# Altium schematic sheet Sheet1.SchDoc
size A
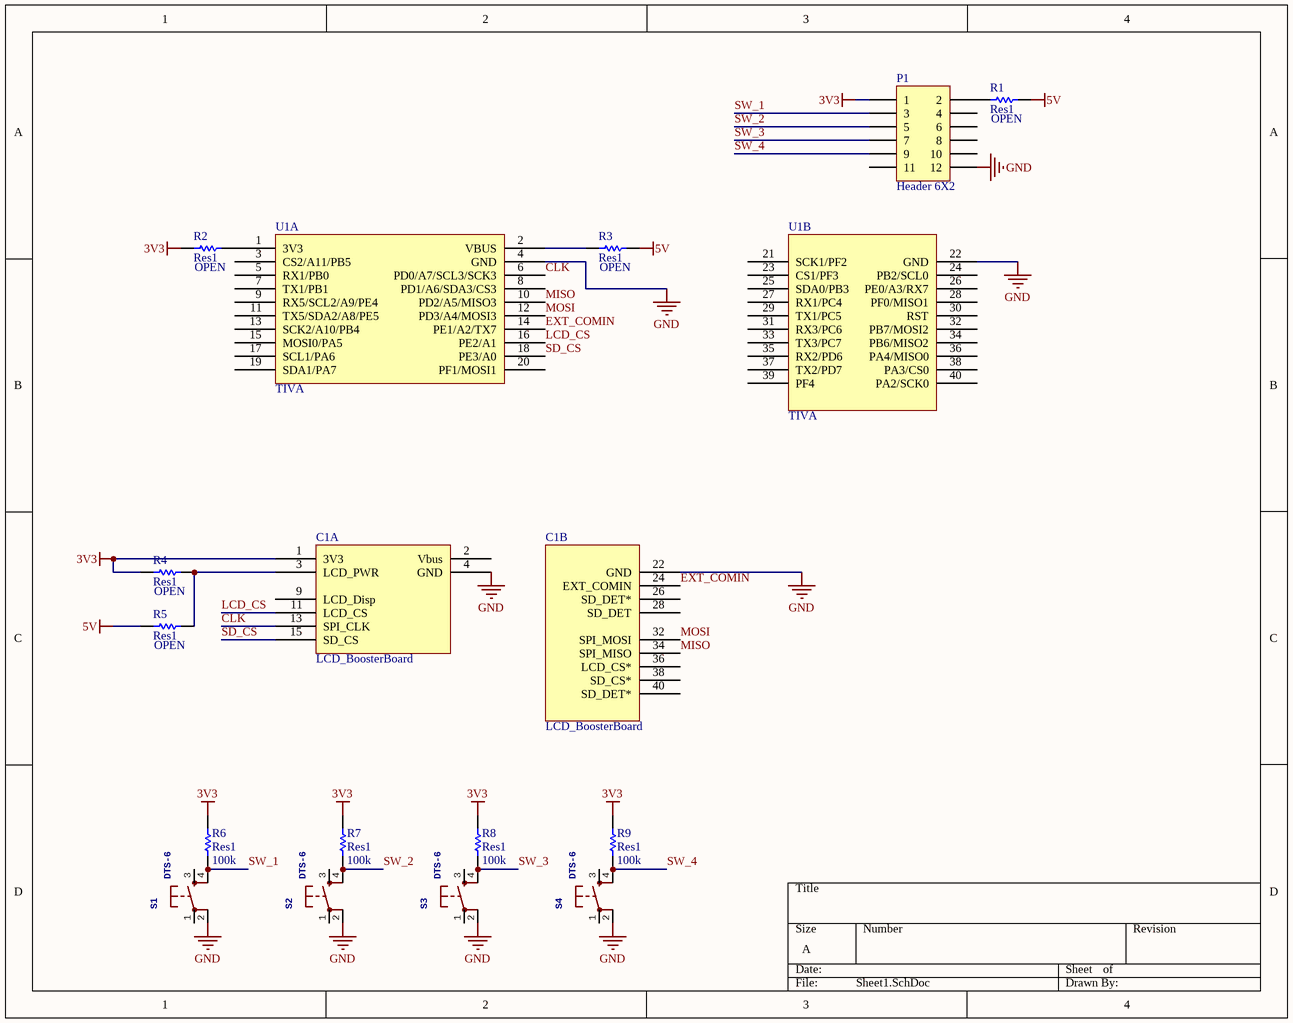
[diagram p0: Sheet1.SchDoc]

## Parts
C1  LCD_BoosterBoard  [TIVA]  (parts A,B of 2)
P1  Header 6X2  [HDR2X6]
R1  Res1  value OPEN  [AXIAL-0.3]
R2  Res1  value OPEN  [AXIAL-0.3]
R3  Res1  value OPEN  [AXIAL-0.3]
R4  Res1  value OPEN  [AXIAL-0.3]
R5  Res1  value OPEN  [AXIAL-0.3]
R6  Res1  value 100k  [AXIAL-0.3]
R7  Res1  value 100k  [AXIAL-0.3]
R8  Res1  value 100k  [AXIAL-0.3]
R9  Res1  value 100k  [AXIAL-0.3]
S1  DTS-6  [DTS-6]
S2  DTS-6  [DTS-6]
S3  DTS-6  [DTS-6]
S4  DTS-6  [DTS-6]
U1  TIVA  [TIVA]  (parts A,B of 2)

## Nets
3V3: C1.1(3V3) P1.1 R2.2 R4.2 R6.2 R7.2 R8.2 R9.2
5V: R1.1 R3.1 R5.2
GND: C1.4(GND) C1.22(GND) P1.12 S1.2 S2.2 S3.2 S4.2 U1.4(GND) U1.22(GND)
CLK: C1.13(SPI_CLK) U1.6(PD0/A7/SCL3/SCK3)
EXT_COMIN: C1.24(EXT_COMIN) U1.14(PE1/A2/TX7)
LCD_CS: C1.11(LCD_CS) U1.16(PE2/A1)
MISO: C1.34(SPI_MISO) U1.10(PD2/A5/MISO3)
MOSI: C1.32(SPI_MOSI) U1.12(PD3/A4/MOSI3)
SD_CS: C1.15(SD_CS) U1.18(PE3/A0)
SW_1: P1.3 R6.1 S1.4
SW_2: P1.5 R7.1 S2.4
SW_3: P1.7 R8.1 S3.4
SW_4: P1.9 R9.1 S4.4
NetC1_3: C1.3(LCD_PWR) R4.1 R5.1
NetP1_2: P1.2 R1.2
NetR2_1: R2.1 U1.1(3V3)
NetR3_2: R3.2 U1.2(VBUS)

Not connected (* = marked no-connect by the designer): C1 2(Vbus) 9(LCD_Disp) 26(SD_DET*) 28(SD_DET) 36(LCD_CS*) 38(SD_CS*) 40(SD_DET*); P1 4 6 8 10 11; S1 1 3; S2 1 3; S3 1 3; S4 1 3; U1 3(CS2/A11/PB5) 5(RX1/PB0) 7(TX1/PB1) 8(PD1/A6/SDA3/CS3) 9(RX5/SCL2/A9/PE4) 11(TX5/SDA2/A8/PE5) 13(SCK2/A10/PB4) 15(MOSI0/PA5) 17(SCL1/PA6) 19(SDA1/PA7) 20(PF1/MOSI1) 21(SCK1/PF2) 23(CS1/PF3) 24(PB2/SCL0) 25(SDA0/PB3) 26(PE0/A3/RX7) 27(RX1/PC4) 28(PF0/MISO1) 29(TX1/PC5) 30(RST) 31(RX3/PC6) 32(PB7/MOSI2) 33(TX3/PC7) 34(PB6/MISO2) 35(RX2/PD6) 36(PA4/MISO0) 37(TX2/PD7) 38(PA3/CS0) 39(PF4) 40(PA2/SCK0)

## Library data of the parts
P1 = Header 6X2: Header, 6-Pin, Dual row; LatestRevisionDate: 17-Jul-2002; LatestRevisionNote: Re-released for DXP Platform.; Publisher: Altium Limited
R1-R9 = Res1: Resistor; Published: 8-Jun-2000; LatestRevisionDate: 17-Jul-2002; LatestRevisionNote: Re-released for DXP Platform.; PackageReference: AXIAL-0.3; Publisher: Altium Limited; PackageDescription: Axial Device, Thru-Hole; 2 Leads; 0.3 in Pin Spacing